# EAGLE design MIBmkII (EAGLE 7.6.0)
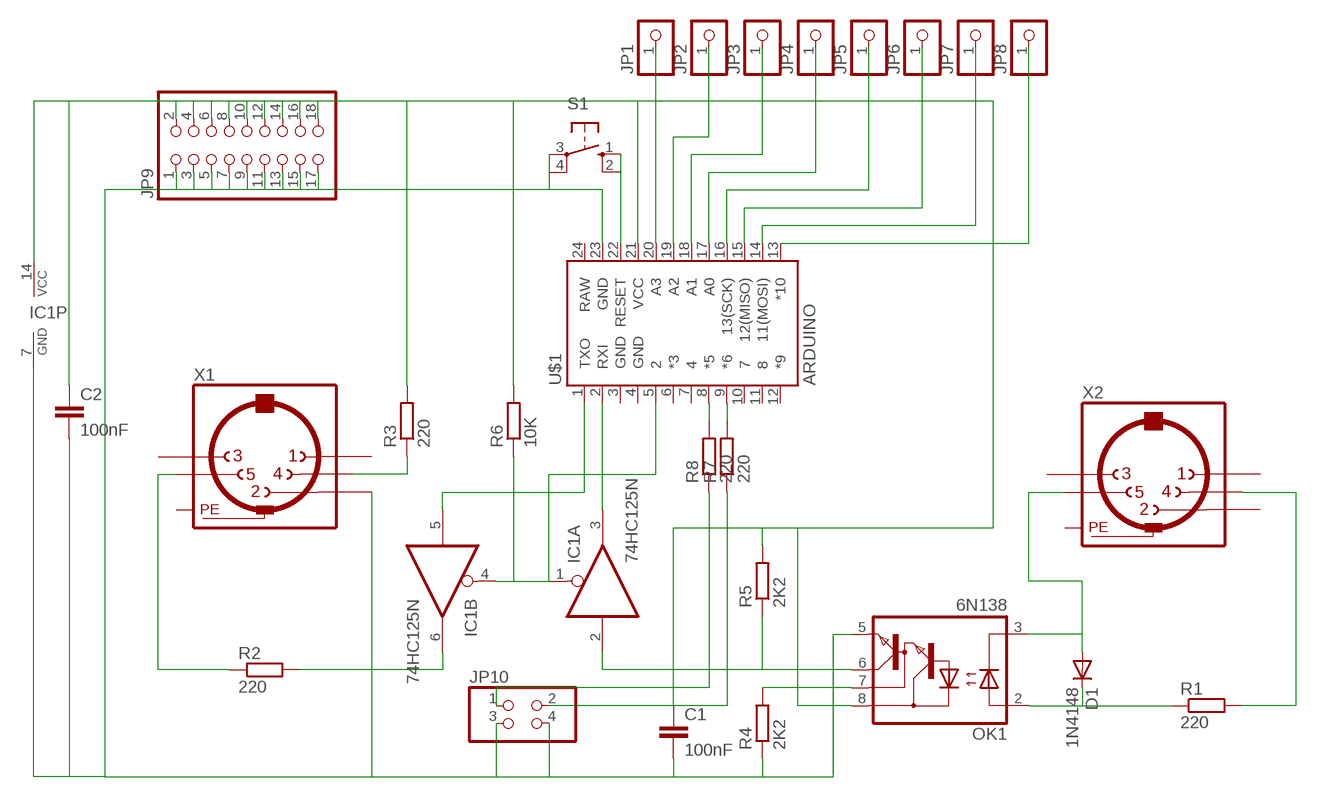
[diagram p0: schematic, sheet 1]

## Parts
C1  100nF  C-EU075-032X103  [C075-032X103]
C2  100nF  C-EU075-032X103  [C075-032X103]
D1  1N4148  1N4148DO35-10  [DO35-10]
IC1  74HC125N  [DIL14]
JP1  PINHD-1X1  [1X01]
JP2  PINHD-1X1  [1X01]
JP3  PINHD-1X1  [1X01]
JP4  PINHD-1X1  [1X01]
JP5  PINHD-1X1  [1X01]
JP6  PINHD-1X1  [1X01]
JP7  PINHD-1X1  [1X01]
JP8  PINHD-1X1  [1X01]
JP9  PINHD-2X9  [2X09]
JP10  PINHD-2X2  [2X02]
OK1  6N138  [DIL08]
R1  220  R-EU_0207/10  [0207/10]
R2  220  R-EU_0207/10  [0207/10]
R3  220  R-EU_0207/10  [0207/10]
R4  2K2  R-EU_0207/10  [0207/10]
R5  2K2  R-EU_0207/10  [0207/10]
R6  10K  R-EU_0207/10  [0207/10]
R7  220  R-EU_0207/10  [0207/10]
R8  220  R-EU_0207/10  [0207/10]
S1  10-XX  [B3F-10XX]
U$1  ARDUINO  ARDUINO_PRO_MICRO  [ARDUINO_PRO_MICRO]
X1  MAB5SH  [MAB5SH]
X2  MAB5SH  [MAB5SH]

## Nets
N$1: IC1.3(A:O) U$1.2(RXI)
N$2: IC1.5(B:I) U$1.1(TXO)
N$3: IC1.1(A:OE) IC1.4(B:OE) R6.1 U$1.5
N$4: C1.1 C2.1 IC1.14(P:VCC) JP9.2 JP9.4 JP9.6 JP9.8 JP9.10 JP9.12 JP9.14 JP9.16 JP9.18 OK1.8(VCC) R3.2 R5.2 R6.2 U$1.21(VCC)
N$5: C1.2 C2.2 IC1.7(P:GND) JP9.1 JP9.3 JP9.5 JP9.7 JP9.9 JP9.11 JP9.13 JP9.15 JP9.17 JP10.3 JP10.4 OK1.5(GND) R4.1 S1.3(P) S1.4(P1) U$1.23(GND) X1.2
N$6: D1.C OK1.2(A) R1.1
N$7: D1.A OK1.3(C) X2.5
N$8: OK1.7(VB) R4.2
N$10: IC1.2(A:I) OK1.6(VO) R5.1
N$11: R3.1 X1.4
N$12: IC1.6(B:O) R2.2
N$13: R2.1 X1.5
N$14: R1.2 X2.4
N$15: JP1.1 U$1.20(A3)
N$16: JP2.1 U$1.19(A2)
N$17: JP3.1 U$1.18(A1)
N$18: JP4.1 U$1.17(A0)
N$19: JP5.1 U$1.16(13(SCK))
N$20: JP6.1 U$1.15(12(MISO))
N$21: JP7.1 U$1.14(11(MOSI))
N$22: JP8.1 U$1.13(*10)
N$31: R7.2 U$1.9(*6)
N$32: R8.2 U$1.8(*5)
N$33: JP10.1 R8.1
N$34: JP10.2 R7.1
N$35: S1.1(S) S1.2(S1) U$1.22(RESET)
Unconnected: IC1.8(C:O) IC1.9(C:I) IC1.10(C:OE) IC1.11(D:O) IC1.12(D:I) IC1.13(D:OE) U$1.3(GND) U$1.4(GND) U$1.6(*3) U$1.7 U$1.10 U$1.11 U$1.12(*9) U$1.24(RAW) X1.1 X1.3 X2.1 X2.2 X2.3

## Power pins joined to a net without a drawn wire
PE: X1.PE X1.PE@(PE) X2.PE X2.PE@(PE)

## Library data of the parts
C1 C2 = rcl:C-EU: CAPACITOR, European symbol
D1 = diode:1N4148: DIODE high speed (Philips)
IC1 = 74xx-eu:74*125: Quad bus BUFFER, 3-state
JP1-JP8 = pinhead:PINHD-1X1: PIN HEADER
JP9 = pinhead:PINHD-2X9: PIN HEADER
JP10 = pinhead:PINHD-2X2: PIN HEADER
OK1 = optocoupler:6N138: MOTOROLA OPTO COUPLER; MF: VISHAY/TELEFUNKEN; MPN: 6N138; OC_FARNELL: 9860150; OC_NEWARK: 35K5294
R1-R8 = resistor:R-EU_: RESISTOR, European symbol
S1 = switch-omron:10-XX: OMRON SWITCH; MPN: B3F-1000; OC_FARNELL: 176432; OC_NEWARK: 36M3542
U$1 = SparkFun-Boards:ARDUINO_PRO_MICRO
X1 X2 = con-hirschmann:MAB5SH: Female CONNECTOR 5 pins 90 deg. with shield, horizontal (DIN 41524); OC_FARNELL: 809883; OC_NEWARK: unknown

## Board
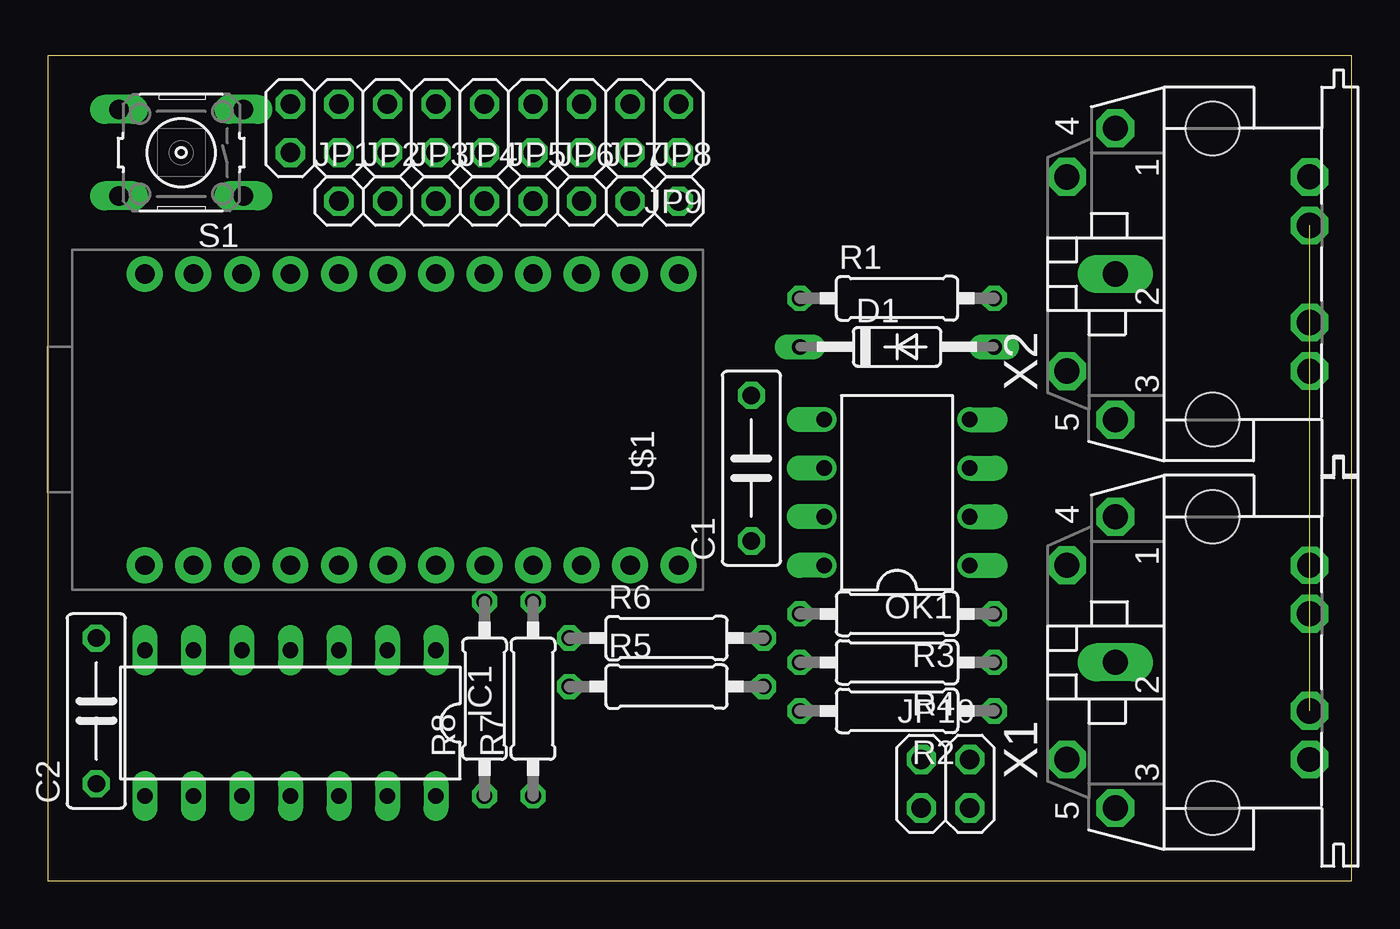
[diagram p1: board, top side]
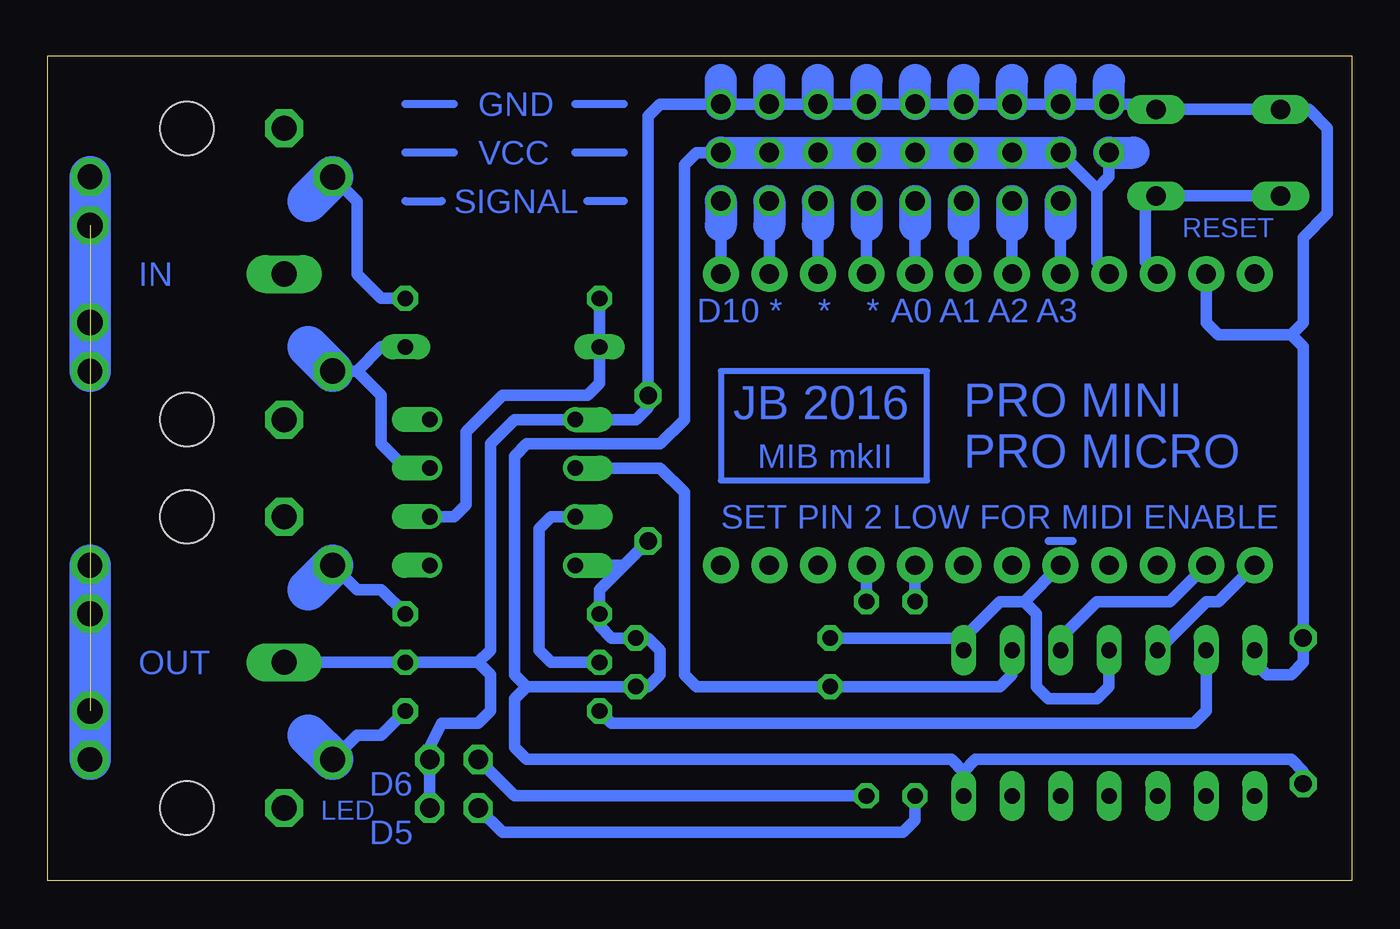
[diagram p2: board, bottom side, seen from below]

Size 68.25 x 43.17 mm. Coordinates in mm from the lower left corner, seen from the top.
Outline: 0,0 68.25,0 68.25,43.17 0,43.17 0,0
Copper layers (1*16): Top 0.035mm / dielectric 1.5mm / Bottom 0.035mm
Design rules "default *": minimum track width 10mil, minimum drill 24mil, track to track 8mil, track to pad 8mil, pad to pad 8mil, via to via 8mil, smd to smd 8mil, copper to edge 40mil, drill to drill 8mil, minimum pad ring 10mil, minimum via ring 8mil, stop-mask expansion 4mil, vias tented up to drill 0mil, thermal gap 10mil

### Footprints (pad centres in the part's own frame; a part is rotated, then mirrored left to right if it is on the bottom)
C075-032X103 = drill 0.914 octagon: 1 -3.81,0; 2 3.81,0
DO35-10 = drill 0.813 long: A 5.08,0; C -5.08,0
DIL14 = drill 0.813 long: 1 -7.62,-3.81; 2 -5.08,-3.81; 3 -2.54,-3.81; 4 0,-3.81; 5 2.54,-3.81; 6 5.08,-3.81; 7 7.62,-3.81; 8 7.62,3.81; 9 5.08,3.81; 10 2.54,3.81; 11 0,3.81; 12 -2.54,3.81; 13 -5.08,3.81; 14 -7.62,3.81
1X01 = drill 1.016 octagon: 1 0,0
2X09 = drill 1.016 octagon: 1 -10.16,-1.27; 2 -10.16,1.27; 3 -7.62,-1.27; 4 -7.62,1.27; 5 -5.08,-1.27; 6 -5.08,1.27; 7 -2.54,-1.27; 8 -2.54,1.27; 9 0,-1.27; 10 0,1.27; 11 2.54,-1.27; 12 2.54,1.27; 13 5.08,-1.27; 14 5.08,1.27; 15 7.62,-1.27; 16 7.62,1.27; 17 10.16,-1.27; 18 10.16,1.27
2X02 = drill 1.016 octagon: 1 -1.27,-1.27; 2 -1.27,1.27; 3 1.27,-1.27; 4 1.27,1.27
DIL08 = drill 0.813 offset: 1 -3.81,-3.81; 2 -1.27,-3.81; 3 1.27,-3.81; 4 3.81,-3.81; 5 3.81,3.81; 6 1.27,3.81; 7 -1.27,3.81; 8 -3.81,3.81
0207/10 = drill 0.813 octagon: 1 -5.08,0; 2 5.08,0
B3F-10XX = drill 1.016 long: 1 -3.251,2.261; 2 3.251,2.261; 3 -3.251,-2.261; 4 3.251,-2.261
ARDUINO_PRO_MICRO = drill 1.016 pad 1.88: 1 -7.62,12.7; 2 -7.62,10.16; 3 -7.62,7.62; 4 -7.62,5.08; 5 -7.62,2.54; 6 -7.62,0; 7 -7.62,-2.54; 8 -7.62,-5.08; 9 -7.62,-7.62; 10 -7.62,-10.16; 11 -7.62,-12.7; 12 -7.62,-15.24; 13 7.62,-15.24; 14 7.62,-12.7; 15 7.62,-10.16; 16 7.62,-7.62; 17 7.62,-5.08; 18 7.62,-2.54; 19 7.62,0; 20 7.62,2.54; 21 7.62,5.08; 22 7.62,7.62; 23 7.62,10.16; 24 7.62,12.7
MAB5SH = drill 1.321 octagon: 1 7.62,5.08; 3 -7.62,5.08; 4 5.08,7.62; 5 -5.08,7.62; PE -2.54,-5.08; PE@ 2.54,-5.08 | drill 1.321 long: 2 0,5.08 | hole 2.794: 7.62,0; -7.62,0

### Placement (x,y rotation side)
C1  36.83,21.59 90 top
C2  2.54,8.89 90 top
D1  44.45,27.94 0 top
IC1  12.7,8.25 180 top
JP1  15.24,35.56 0 top
JP2  17.78,35.56 0 top
JP3  20.32,35.56 0 top
JP4  22.86,35.56 0 top
JP5  25.4,35.56 0 top
JP6  27.94,35.56 0 top
JP7  30.48,35.56 0 top
JP8  33.02,35.56 0 top
JP9  22.86,39.37 180 top
JP10  46.99,5.08 0 top
OK1  44.45,20.32 90 top
R1  44.45,30.48 0 top
R2  44.45,8.89 180 top
R3  44.45,13.97 180 top
R4  44.45,11.43 180 top
R5  32.38,10.16 0 top
R6  32.38,12.7 0 top
R7  25.4,9.52 90 top
R8  22.86,9.52 90 top
S1  6.99,38.1 180 top
U$1  17.78,24.13 90 top
X1  60.96,11.43 90 top
X2  60.96,31.75 90 top

### Tracks (layer width: path | path; a pad name or v marks a point on that pad's centre or on a via)
N$1
  Bottom 0.61: IC1.3 15.24,12.7 13.33,14.6 9.53,14.6 U$1.2
N$2
  Bottom 0.61: IC1.5 7.62,14.6 6.99,14.6 U$1.1
N$3
  Bottom 0.61: U$1.5 17.15,14.6 | 17.15,14.6 18.41,14.6 20.32,12.7 | 20.32,12.7 IC1.1 | IC1.4 12.7,10.16 13.33,9.52 15.88,9.52 16.51,10.16 16.51,13.97 17.15,14.6 | R6.1 20.32,12.7
N$4
  Bottom 0.61: 43.18,10.16 43.81,9.52 43.81,6.98 43.18,6.35 20.95,6.35 20.32,5.71 | 43.18,10.16 43.81,10.79 43.81,22.23 43.18,22.86 36.2,22.86 34.92,24.13 34.92,37.46 34.29,38.1 JP9.2 JP9.4 JP9.6 JP9.8 JP9.10 JP9.12 JP9.14 JP9.16 13.33,36.2 | 13.33,36.2 13.33,32.38 U$1.21 | C1.1 38.1,16.51 | 38.1,16.51 OK1.8 | 38.1,16.51 39.37,15.24 R3.2 39.37,13.33 38.73,12.7 R6.2 36.83,12.7 36.2,12.06 36.2,10.79 36.83,10.16 R5.2 43.18,10.16 | IC1.14 20.32,5.71 | 20.32,5.71 19.69,6.35 3.18,6.35 2.54,5.71 C2.1 | 13.33,36.2 12.7,36.83 JP9.18
  Bottom 1.676: JP9.2 JP9.16 | JP9.18 11.43,38.1
N$5
  Bottom 0.61: 45.72,11.43 45.09,12.06 45.09,22.86 43.81,24.13 OK1.5 37.46,24.13 36.83,24.77 C1.2 36.83,40 36.2,40.64 JP9.1 JP9.3 JP9.5 JP9.7 JP9.9 JP9.11 JP9.13 JP9.15 JP9.17 9.88,40.64 S1.3 S1.4 2.26,40.36 1.27,39.37 1.27,34.92 2.54,33.66 2.54,29.21 3.18,28.57 | 45.72,11.43 R4.1 X1.2 | JP10.3 JP10.4 48.26,6.98 47.62,8.25 45.72,8.25 45.09,8.89 45.09,10.79 45.72,11.43 | IC1.7 5.08,11.43 4.45,10.79 3.18,10.79 2.54,11.43 C2.2 2.54,27.94 3.18,28.57 | 3.18,28.57 6.99,28.57 7.62,29.21 U$1.23
  Bottom 1.676: JP9.1 33.02,41.91 | JP9.3 30.48,41.91 | JP9.5 27.94,41.91 | JP9.7 25.4,41.91 | JP9.9 22.86,41.91 | JP9.11 20.32,41.91 | JP9.13 17.78,41.91 | JP9.15 15.24,41.91 | JP9.17 12.7,41.91
N$6
  Bottom 0.61: OK1.2 46.99,19.05 46.35,19.69 46.35,23.49 44.45,25.4 40,25.4 39.37,26.03 D1.C R1.1
N$7
  Bottom 0.61: OK1.3 49.53,21.59 50.8,22.86 50.8,25.4 52.07,26.67 | 52.07,26.67 X2.5 | 52.07,26.67 50.8,27.94 D1.A
  Bottom 2.184: X2.5 54.61,27.94
N$8
  Bottom 0.61: R4.2 41.91,11.43 42.55,12.06 42.55,18.41 41.91,19.05 OK1.7
N$10
  Bottom 0.61: IC1.2 17.78,10.79 18.41,10.16 R5.1 34.29,10.16 34.92,10.79 34.92,20.32 36.2,21.59 OK1.6
N$11
  Bottom 0.61: R3.1 50.8,15.24 52.07,15.24 X1.4
  Bottom 2.184: X1.4 54.61,15.24
N$12
  Bottom 0.61: IC1.6 7.62,8.89 8.26,8.25 38.73,8.25 R2.2
N$13
  Bottom 0.61: R2.1 50.8,7.62 52.07,7.62 X1.5
  Bottom 2.184: X1.5 54.61,7.62
N$14
  Bottom 0.61: R1.2 50.8,30.48 52.07,31.75 52.07,35.56 X2.4
  Bottom 2.184: X2.4 54.61,35.56
N$15
  Bottom 0.61: U$1.20 15.24,34.29
  Bottom 1.676: JP1.1 15.24,34.29
N$16
  Bottom 0.61: U$1.19 17.78,34.29
  Bottom 1.676: JP2.1 17.78,34.29
N$17
  Bottom 0.61: U$1.18 20.32,34.29
  Bottom 1.676: JP3.1 20.32,34.29
N$18
  Bottom 0.61: U$1.17 22.86,34.29
  Bottom 1.676: JP4.1 22.86,34.29
N$19
  Bottom 0.61: U$1.16 25.4,34.29
  Bottom 1.676: JP5.1 25.4,34.29
N$20
  Bottom 0.61: U$1.15 27.94,34.29
  Bottom 1.676: JP6.1 27.94,34.29
N$21
  Bottom 0.61: U$1.14 30.48,34.29
  Bottom 1.676: JP7.1 30.48,34.29
N$22
  Bottom 0.61: U$1.13 33.02,34.29
  Bottom 1.676: JP8.1 33.02,34.29
N$23  (via drill 1.3 pad 1.93)
  Bottom 2.184: v66.04,16.51 v66.04,6.35
N$25  (via drill 1.3 pad 1.93)
  Bottom 2.184: v66.04,36.83 v66.04,26.67
N$26
  Bottom 0.406: 14.6,17.78 15.88,17.78
N$27
  Bottom 0.406: 38.1,40.64 40.64,40.64
N$28
  Bottom 0.406: 38.1,38.1 40.64,38.1
N$29
  Bottom 0.406: 38.1,35.56 40,35.56
N$30
  Bottom 0.305: 22.23,20.95 22.23,26.67 33.02,26.67 33.02,20.95 22.23,20.95
N$31
  Bottom 0.61: U$1.9 R7.2
N$32
  Bottom 0.61: U$1.8 R8.2
N$33
  Bottom 0.61: R8.1 22.86,3.17 23.18,2.86 23.49,2.54 44.45,2.54 JP10.1
N$34
  Bottom 0.61: JP10.2 43.81,4.45 R7.1
N$35
  Bottom 0.61: S1.2 S1.1 10.79,35.28 10.79,32.38 U$1.22
N$36
  Bottom 0.406: 46.99,40.64 49.53,40.64
N$37
  Bottom 0.406: 46.99,38.1 49.53,38.1
N$38
  Bottom 0.406: 49.53,35.56 47.62,35.56
PE  (3 unrouted)

### Text on the board
Bottom: GND | VCC | SIGNAL | RESET | IN | A3 | A2 | A1 | A0 | * | * | * | D10 | JB 2016 | PRO MINI / PRO MICRO | MIB mkII | SET PIN 2 LOW FOR MIDI ENABLE | OUT | D6 | LED | D5
tValues: G | IN | JB 2016 | V | MIB mkII | S | D6 | LED | D5 | OUT